# EAGLE schematic main_module (EAGLE 9.3.1)
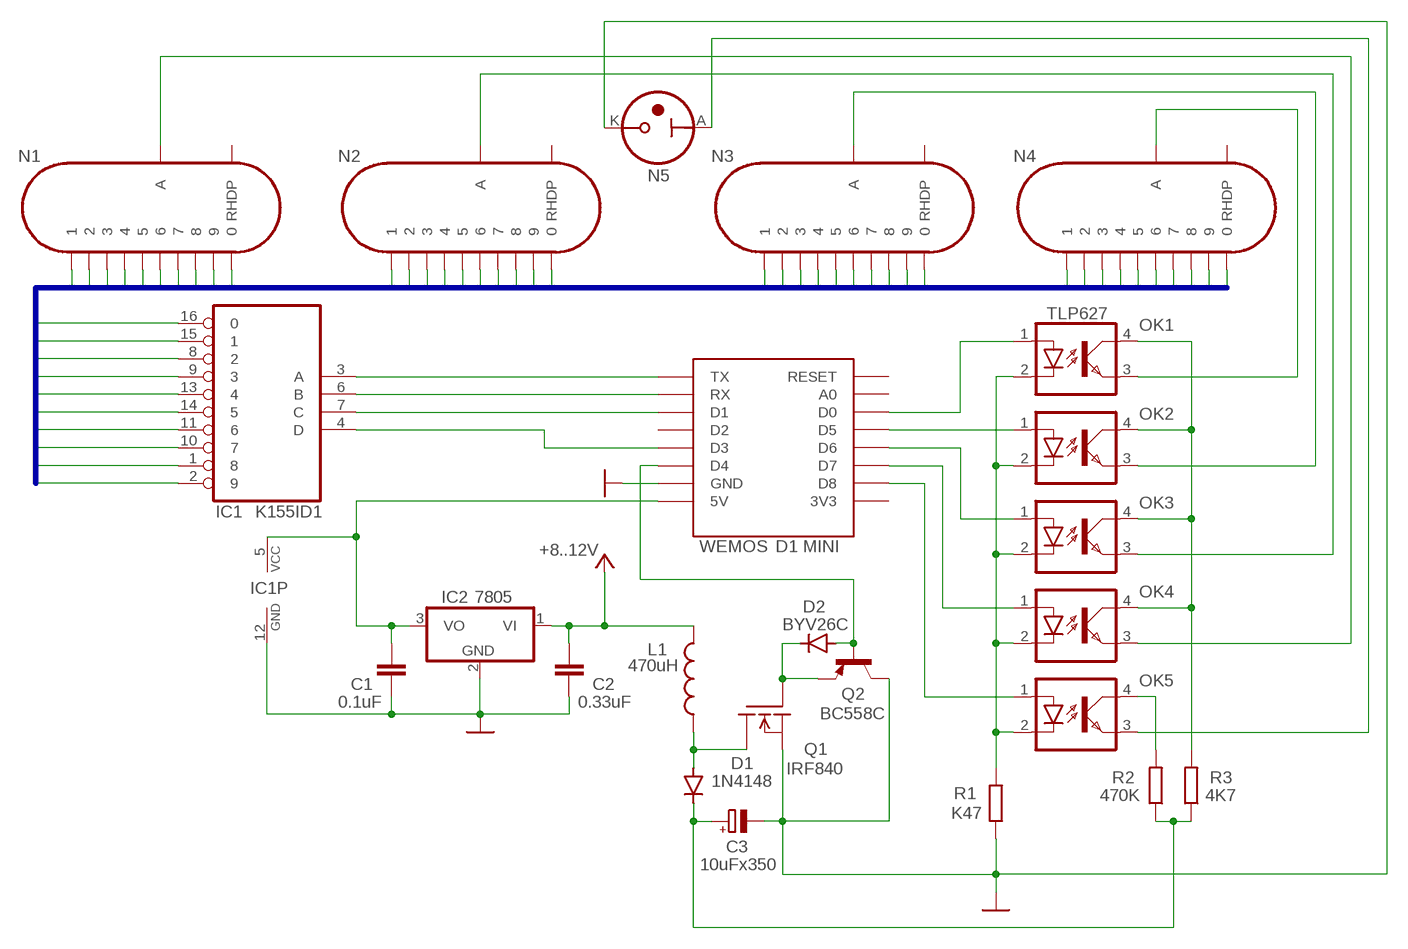
[diagram p0: schematic, sheet 1]

## Parts
C1  0.1uF  C-EU075-052X106  [C075-052X106]
C2  0.33uF  C-EU075-052X106  [C075-052X106]
C3  10uFx350  CPOL-EUE5-10.5  [E5-10,5]
D1  1N4148  1N4148DO35-10  [DO35-10]
D2  BYV26C  BYV27  [SOD57-10]
IC1  K155ID1  74141N  [DIL16]
IC2  7805  7805T  [TO220H]
L1  470uH  L-US6000-XXX-RC  [6000-XXXX-RC]
N1  IN-8-2  [IN-8-2]
N2  IN-8-2  [IN-8-2]
N3  IN-8-2  [IN-8-2]
N4  IN-8-2  [IN-8-2]
N5  IN-3  [IN-3]
OK1  TLP627  LTV816  [DIL04]
OK2  LTV816  [DIL04]
OK3  LTV816  [DIL04]
OK4  LTV816  [DIL04]
OK5  LTV816  [DIL04]
Q1  IRF840  [TO220]
Q2  BC558C  [TO92-EBC]
R1  K47  R-EU_0207/12  [0207/12]
R2  470K  R-EU_0207/12  [0207/12]
R3  4K7  R-EU_0207/12  [0207/12]
WEMOS  D1 MINI  WEMOS-D1-MINI  [WEMOS-D1-MINI]

## Nets
GND: C1.2 C2.2 C3.- IC1.12(GND) IC2.2(GND) N5.K Q1.3(S) Q2.C R1.1 WEMOS.GND
N0: IC1.16 N1.0 N2.0 N3.0 N4.0
N1: IC1.15 N1.1 N2.1 N3.1 N4.1
N2: IC1.8 N1.2 N2.2 N3.2 N4.2
N3: IC1.9 N1.3 N2.3 N3.3 N4.3
N4: IC1.13 N1.4 N2.4 N3.4 N4.4
N5: IC1.14 N1.5 N2.5 N3.5 N4.5
N6: IC1.11 N1.6 N2.6 N3.6 N4.6
N7: IC1.10 N1.7 N2.7 N3.7 N4.7
N8: IC1.1 N1.8 N2.8 N3.8 N4.8
N9: IC1.2 N1.9 N2.9 N3.9 N4.9
N$1: IC1.3(A) WEMOS.TX
N$2: IC1.6(B) WEMOS.RX
N$3: IC1.7(C) WEMOS.D1
N$4: IC1.4(D) WEMOS.D3
N$5: OK1.1(A) WEMOS.D0
N$6: OK2.1(A) WEMOS.D5
N$7: OK3.1(A) WEMOS.D6
N$8: OK4.1(A) WEMOS.D7
N$9: OK5.1(A) WEMOS.D8
N$10: OK1.2(C) OK2.2(C) OK3.2(C) OK4.2(C) OK5.2(C) R1.2
N$11: N4.A OK1.3(EMIT)
N$12: N3.A OK2.3(EMIT)
N$13: N2.A OK3.3(EMIT)
N$14: N1.A OK4.3(EMIT)
N$15: OK1.4(COL) OK2.4(COL) OK3.4(COL) OK4.4(COL) R3.2
N$16: OK5.4(COL) R2.2
N$17: N5.A OK5.3(EMIT)
N$18: C1.1 IC1.5(VCC) IC2.3(VO) WEMOS.5V
N$19: D2.C Q1.1(G) Q2.E
N$20: D1.A L1.1 Q1.2(D)
N$21: C3.+ D1.C R2.1 R3.1
N$23: D2.A Q2.B WEMOS.D4
VCC: C2.1 IC2.1(VI) L1.2 ; supply symbol labelled +8..12V
Unconnected: N1..(RHDP) N2..(RHDP) N3..(RHDP) N4..(RHDP) WEMOS.3V3 WEMOS.A0 WEMOS.D2 WEMOS.RESET

## Buses
N[0..9]

## Library data of the parts
C1 C2 = rcl:C-EU: CAPACITOR, European symbol; DESC: К10-17; SPICEPREFIX: C
C3 = rcl:CPOL-EU: POLARIZED CAPACITOR, European symbol; DESC: K50-35; SPICEPREFIX: C
D1 = diode:1N4148: DIODE high speed (Philips)
D2 = diode:BYV27: DIODE ultra fast
IC1 = 74xx-eu:74*141: BCD to decimal DECODER/DRIVER
IC2 = linear:78*: Positive VOLTAGE REGULATOR Source: http://cache.national.com/ds/LM/LM78L05.pdf http://www.fairchildsemi.com/ds/LM/LM7805.pdf
L1 = rcl:L-US: INDUCTOR, American symbol; SPICEPREFIX: L
N1-N4 = russian-nixies:IN-8-2: IN-8-2: medium numeric frontview nixie tube
N5 = russian-nixies:IN-3: IN-3: nixie bulb
OK1-OK5 = optocoupler:LTV816: OPTO COUPLER Source: LITEON, LTV816.pdf; OC_FARNELL: unknown; OC_NEWARK: unknown
Q1 = transistor-fet:IRF840: N-Channel Enhancement MOSFET (HEXFET); 500V; 8A; 0,85Ohm
Q2 = transistor-pnp:BC558*: PNP Transistror
R1-R3 = rcl:R-EU_: RESISTOR, European symbol; SPICEPREFIX: R
WEMOS = esp8266modules:WEMOS-D1-MINI: WeMos.cc D1 mini ESP8266 module